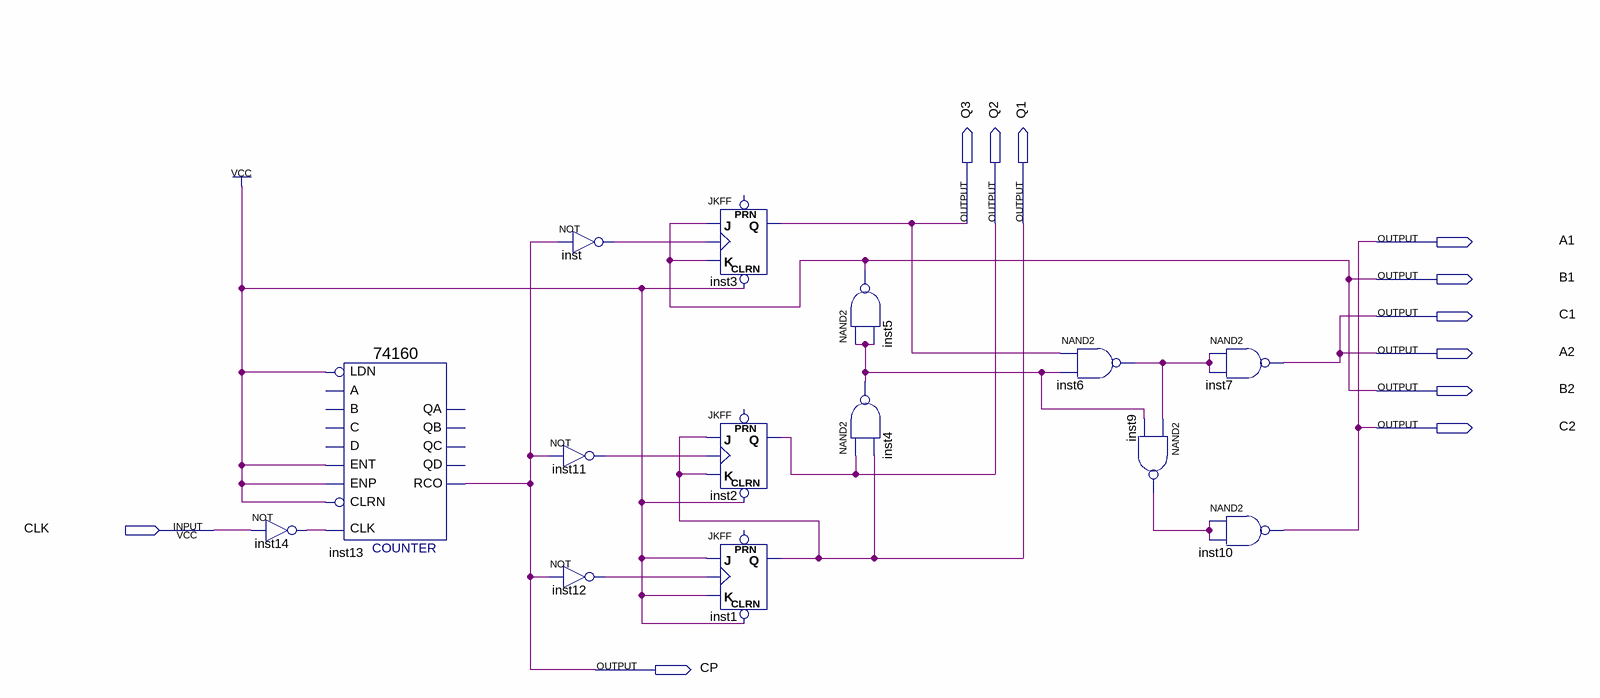
[diagram p0: schematic sheet]
// Quartus schematic project1(十进制).bdf as structural Verilog: 14 symbols, 11 pins
module \project1(十进制)  (
  input  CLK,
  output Q3,
  output Q2,
  output Q1,
  output A1,
  output B1,
  output C1,
  output A2,
  output B2,
  output C2,
  output CP
);

  wire inst4_out, inst6_out, inst9_out, inst11_out, inst12_out, inst14_out, inst_out;

  not inst14 (inst14_out, CLK);
  \74160  inst13 (
    .CLK(inst14_out), .ENT(1'b1), .LDN(1'b1), .ENP(1'b1), .CLRN(1'b1), .RCO(CP));  // open: A, B, C, D, QD, QA, QB, QC
  not inst (inst_out, CP);
  not inst11 (inst11_out, CP);
  not inst12 (inst12_out, CP);
  JKFF inst3 (.CLRN(1'b1), .K(B1), .J(B1), .CLK(inst_out), .Q(Q3));  // open: PRN
  JKFF inst2 (.CLRN(1'b1), .K(Q1), .J(Q1), .CLK(inst11_out), .Q(Q2));  // open: PRN
  JKFF inst1 (.CLRN(1'b1), .K(1'b1), .J(1'b1), .CLK(inst12_out), .Q(Q1));  // open: PRN
  nand inst5 (B1, inst4_out, inst4_out);
  nand inst4 (inst4_out, Q2, Q1);
  nand inst6 (inst6_out, Q3, inst4_out);
  nand inst9 (inst9_out, inst6_out, inst4_out);
  nand inst7 (A2, inst6_out, inst6_out);
  nand inst10 (A1, inst9_out, inst9_out);

  assign B2 = B1;
  assign C1 = A2;
  assign C2 = A1;
endmodule
